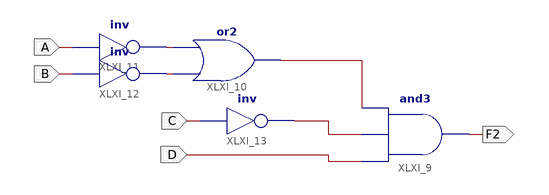
[diagram p0: schematic sheet 1]
// Xilinx ISE schematic p1simple.sch (spartan3e) as structural Verilog: 5 symbols, 5 ports
module p1simple (
  input  A,
  input  B,
  input  C,
  input  D,
  output F2
);

  wire XLXN_26, XLXN_27, XLXN_28, XLXN_29;

  or XLXI_10 (XLXN_28, XLXN_27, XLXN_26);
  not XLXI_11 (XLXN_26, A);
  not XLXI_12 (XLXN_27, B);
  and XLXI_9 (F2, D, XLXN_29, XLXN_28);
  not XLXI_13 (XLXN_29, C);
endmodule
